# EAGLE design wide_vias (EAGLE 4.16)
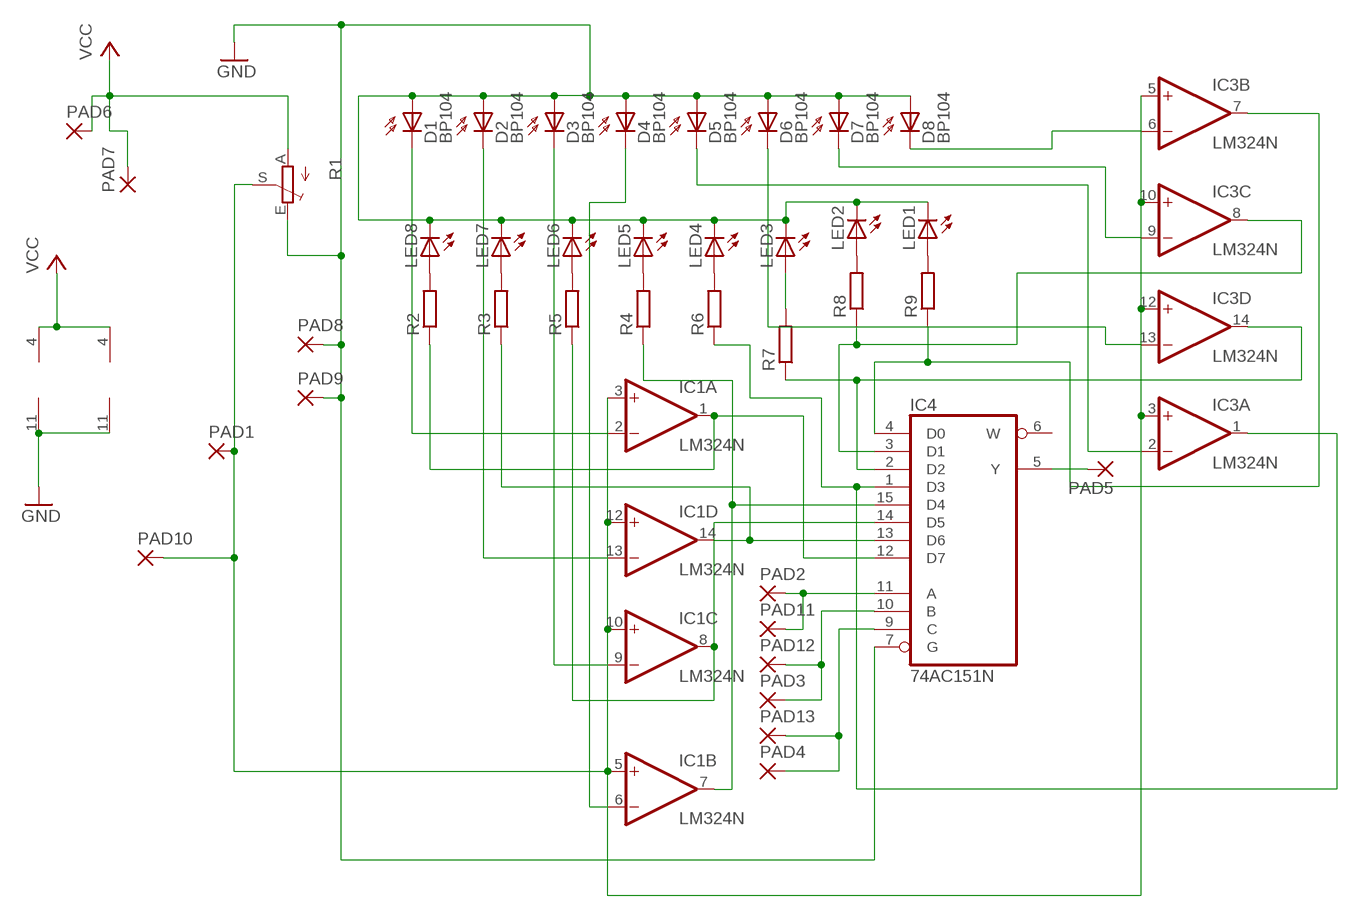
[diagram p0: schematic, sheet 1]

## Parts
D1  BP104  [BP104]
D2  BP104  [BP104]
D3  BP104  [BP104]
D4  BP104  [BP104]
D5  BP104  [BP104]
D6  BP104  [BP104]
D7  BP104  [BP104]
D8  BP104  [BP104]
IC1  LM324N  [DIL14]
IC3  LM324N  [DIL14]
IC4  74AC151N  [DIL16]
LED1  LED3MM  [LED3MM]
LED2  LED3MM  [LED3MM]
LED3  LED3MM  [LED3MM]
LED4  LED3MM  [LED3MM]
LED5  LED3MM  [LED3MM]
LED6  LED3MM  [LED3MM]
LED7  LED3MM  [LED3MM]
LED8  LED3MM  [LED3MM]
PAD1  2,54/1,0  [2,54/1,0]
PAD2  2,54/1,0  [2,54/1,0]
PAD3  2,54/1,0  [2,54/1,0]
PAD4  2,54/1,0  [2,54/1,0]
PAD5  2,54/1,0  [2,54/1,0]
PAD6  2,54/1,0  [2,54/1,0]
PAD7  2,54/1,0  [2,54/1,0]
PAD8  2,54/1,0  [2,54/1,0]
PAD9  2,54/1,0  [2,54/1,0]
PAD10  2,54/1,0  [2,54/1,0]
PAD11  2,54/1,0  [2,54/1,0]
PAD12  2,54/1,0  [2,54/1,0]
PAD13  2,54/1,0  [2,54/1,0]
R1  TRIM_EU-B25U  [B25U]
R2  R-EU_0207/10  [0207/10]
R3  R-EU_0207/10  [0207/10]
R4  R-EU_0207/12  [0207/12]
R5  R-EU_0207/12  [0207/12]
R6  R-EU_0207/10  [0207/10]
R7  R-EU_0207/10  [0207/10]
R8  R-EU_0207/10  [0207/10]
R9  R-EU_0207/10  [0207/10]

## Nets
B$1: IC1.1(A:OUT) IC4.12(D7) R2.1
GND: D1.A D2.A D3.A D4.A D5.A D6.A D7.A D8.A IC1.11(P:V-) IC3.11(P:V-) IC4.7(G) LED1.K(C) LED2.K(C) LED3.K(C) LED4.K(C) LED5.K(C) LED6.K(C) LED7.K(C) LED8.K(C) PAD8.1(P) PAD9.1(P) R1.E
N$1: D7.K(C) IC3.9(C:-IN)
N$2: D1.K(C) IC1.2(A:-IN)
N$3: D2.K(C) IC1.13(D:-IN)
N$4: D3.K(C) IC1.9(C:-IN)
N$5: D4.K(C) IC1.6(B:-IN)
N$6: IC1.14(D:OUT) IC4.13(D6) R3.1
N$7: LED1.A R9.2
N$8: IC1.7(B:OUT) IC4.15(D4) R4.1
N$9: D8.K(C) IC3.6(B:-IN)
N$10: LED5.A R4.2
N$11: D6.K(C) IC3.13(D:-IN)
N$12: D5.K(C) IC3.2(A:-IN)
N$13: IC4.5(Y) PAD5.1(P)
N$14: IC4.11(A) PAD2.1(P) PAD11.1(P)
N$15: IC4.10(B) PAD3.1(P) PAD12.1(P)
N$16: IC4.9(C) PAD4.1(P) PAD13.1(P)
N$17: LED2.A R8.2
N$18: IC3.7(B:OUT) IC4.4(D0) R9.1
N$19: IC3.8(C:OUT) IC4.3(D1) R8.1
N$20: IC3.14(D:OUT) IC4.2(D2) R7.1
N$21: IC3.1(A:OUT) IC4.1(D3) R6.1
N$22: LED3.A R7.2
N$23: LED4.A R6.2
N$24: LED6.A R5.2
N$26: LED7.A R3.2
N$27: LED8.A R2.2
N$28: IC1.3(A:+IN) IC1.5(B:+IN) IC1.10(C:+IN) IC1.12(D:+IN) IC3.3(A:+IN) IC3.5(B:+IN) IC3.10(C:+IN) IC3.12(D:+IN) PAD1.1(P) PAD10.1(P) R1.S
N$30: IC1.8(C:OUT) IC4.14(D5) R5.1
VCC: IC1.4(P:V+) IC3.4(P:V+) PAD6.1(P) PAD7.1(P) R1.A
Unconnected: IC4.6(W)

## Power pins joined to a net without a drawn wire
GND: IC4.8(GND)
VCC: IC4.16(VCC)

## Library data of the parts
D1-D8 = opto-trans-siemens:BP104: PHOTO DIODE
IC1 IC3 = linear:LM324: OP AMP
IC4 = 74xx-eu:74*151: Data SELECTOR/MULTIPLEXER
LED1-LED8 = led:LED: LED OSRAM: - CHIPLED LG R971, LG N971, LY N971, LG Q971, LY Q971, LO R971, LY R971 LH N974, LH R974 LS Q976, LO Q976, LY Q976 LO Q996 - Hyper CHIPLED LW Q18S LB Q993, LB Q99A, LB R99A - SideLED LS A670, LO A670, LY A670, LG A670, LP A670 LB A673, LV A673, LT A673, LW A673 LH A674 LY A675 LS A676, LA A676, LO A676, LY A676, LW A676 LS A679, LY A679, LG A679 - Hyper Micro SIDELED® LS Y876, LA Y876, LO Y876, LY Y876 LT Y87S - SmartLED LW L88C, LW L88S LB L89C, LB L89S, LG L890 LS L89K, LO L89K, LY L89K LS L896, LA L896, LO L896, LY L896 - TOPLED LS T670, LO T670, LY T670, LG T670, LP T670 LSG T670, LSP T670, LSY T670, LOP T670, LYG T670 LG T671, LOG T671, LSG T671 LB T673, LV T673, LT T673, LW T673 LH T674 LS T676, LA T676, LO T676, LY T676, LB T676, LH T676, LSB T676, LW T676 LB T67C, LV T67C, LT T67C, LS T67K, LO T67K, LY T67K, LW E67C LS E67B, LA E67B, LO E67B, LY E67B, LB E67C, LV E67C, LT E67C LW T67C LS T679, LY T679, LG T679 LS T770, LO T770, LY T770, LG T770, LP T770 LB T773, LV T773, LT T773, LW T773 LH T774 LS E675, LA E675, LY E675, LS T675 LS T776, LA T776, LO T776, LY T776, LB T776 LHGB T686 LT T68C, LB T68C - Hyper Mini TOPLED® LB M676 - Mini TOPLED Santana® LG M470 LS M47K, LO M47K, LY M47K Source: http://www.osram.convergy.de/
PAD1-PAD13 = wirepad:2,54/1,0: THROUGH-HOLE PAD
R1 = pot:TRIM_EU-: POTENTIOMETER
R2-R9 = rcl:R-EU_: RESISTOR, European symbol

## Board
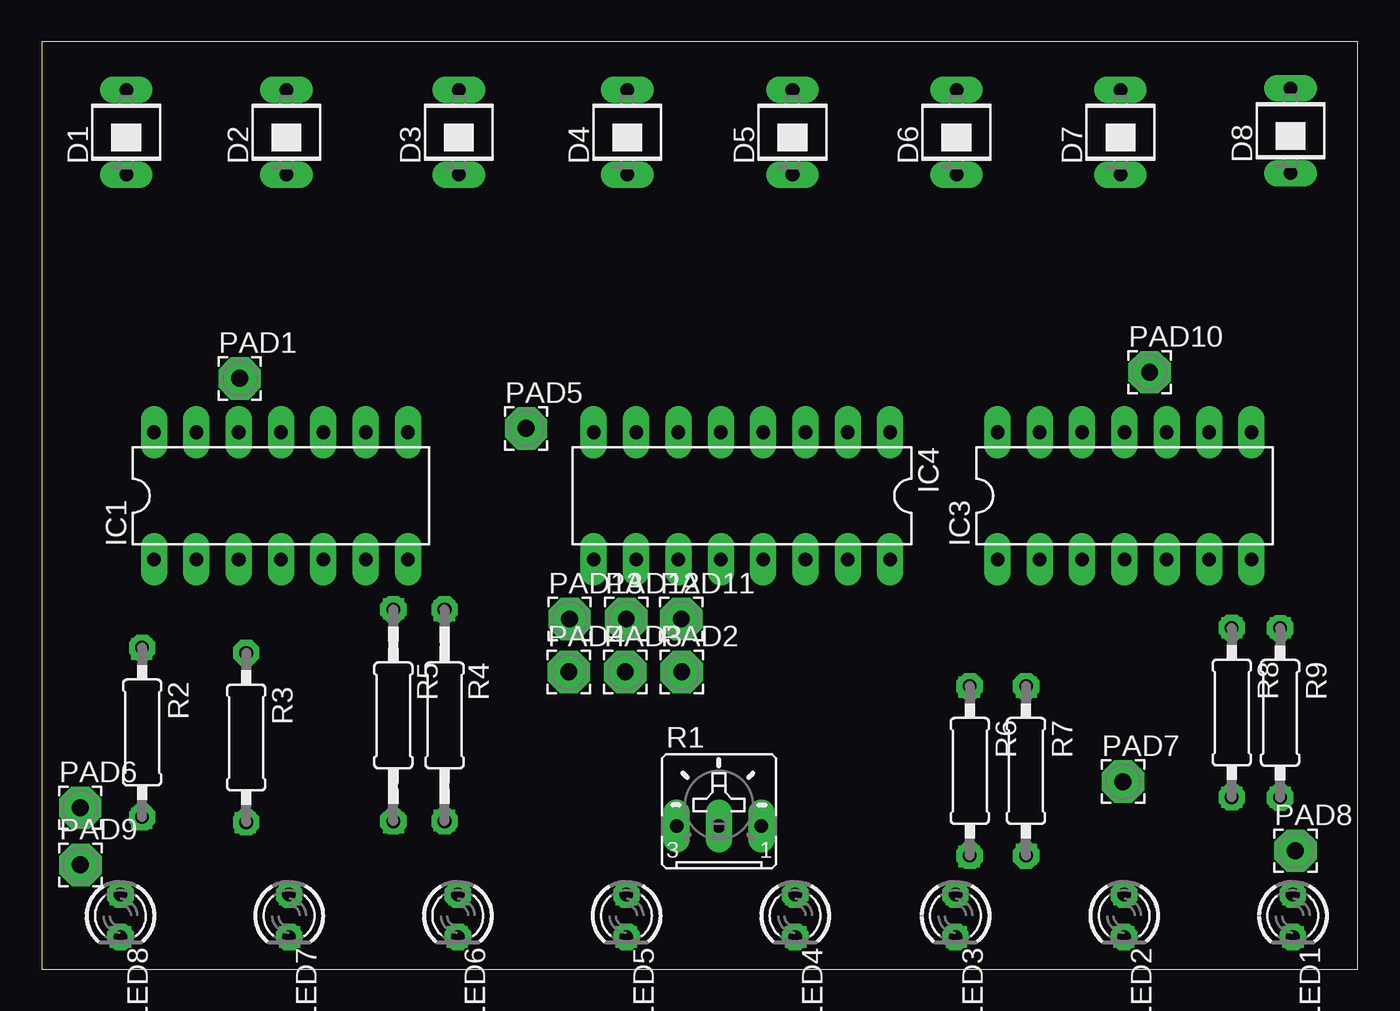
[diagram p1: board, top side]
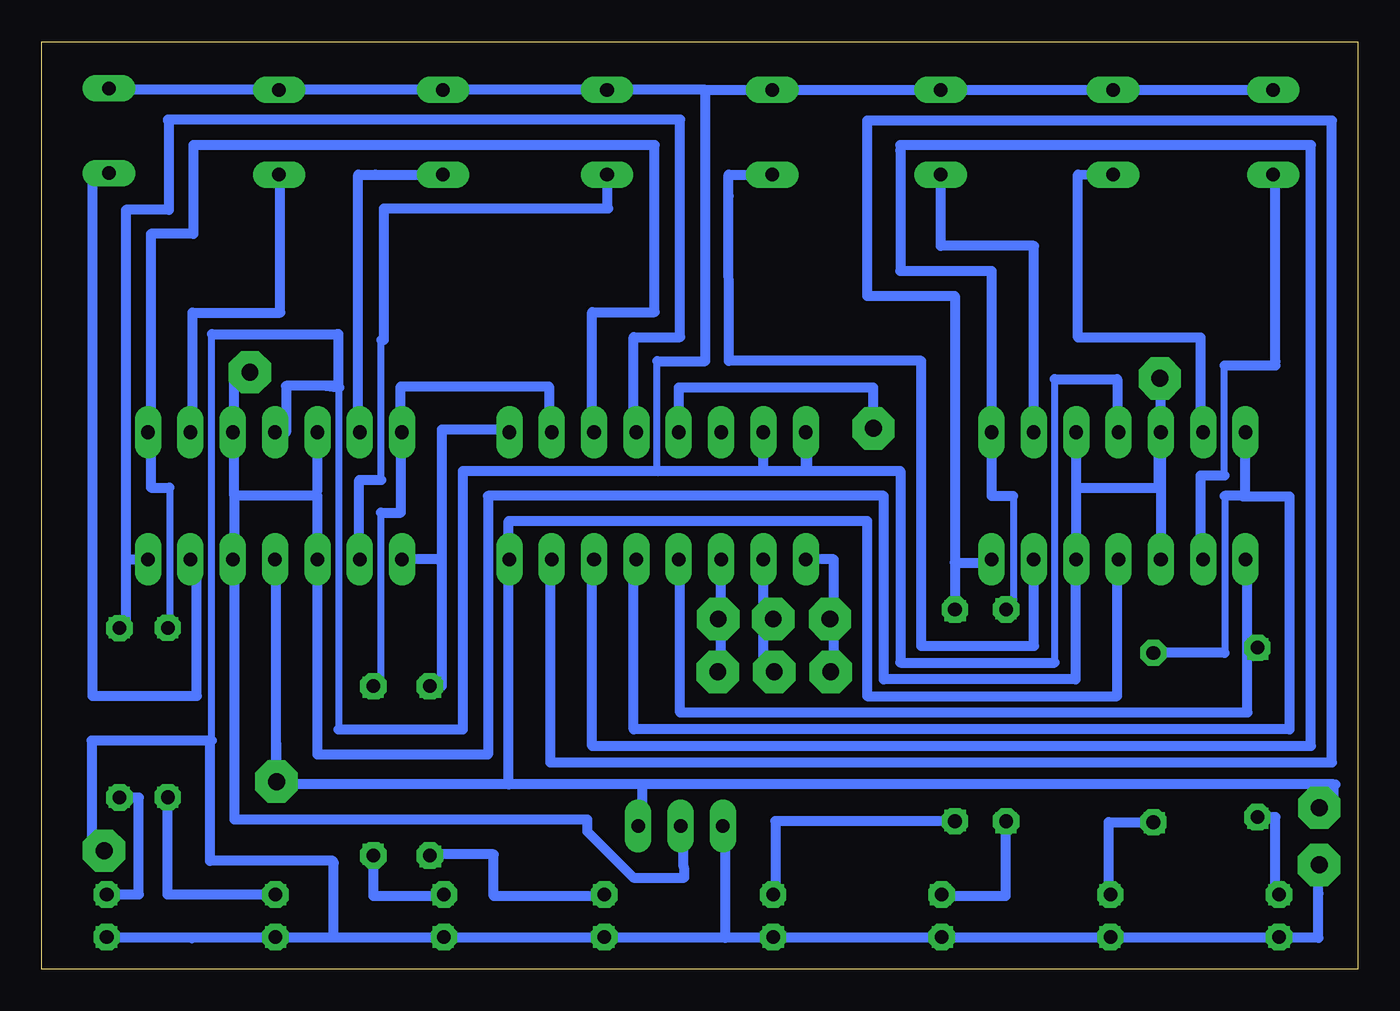
[diagram p2: board, bottom side, seen from below]

Size 78.97 x 55.62 mm. Coordinates in mm from the lower left corner, seen from the top.
Outline: 0,0 78.97,0 78.97,55.62 0,55.62 0,0
Copper layers (1*16): Top 0.035mm / dielectric 1.5mm / Bottom 0.035mm
Design rules "default": minimum track width 10mil, minimum drill 10mm, track to track 8mil, track to pad 8mil, pad to pad 8mil, via to via 8mil, smd to smd 8mil, copper to edge 40mil, drill to drill 8mil, minimum pad ring 15mil, minimum via ring 8mil, stop-mask expansion 4mil, vias tented up to drill 0mil, thermal gap 10mil

### Footprints (pad centres in the part's own frame; a part is rotated, then mirrored left to right if it is on the bottom)
BP104 = drill 0.813 long: A 0,2.54; K 0,-2.54
DIL14 = drill 0.813 long: 1 -7.62,-3.81; 2 -5.08,-3.81; 3 -2.54,-3.81; 4 0,-3.81; 5 2.54,-3.81; 6 5.08,-3.81; 7 7.62,-3.81; 8 7.62,3.81; 9 5.08,3.81; 10 2.54,3.81; 11 0,3.81; 12 -2.54,3.81; 13 -5.08,3.81; 14 -7.62,3.81
DIL16 = drill 0.813 long: 1 -8.89,-3.81; 2 -6.35,-3.81; 3 -3.81,-3.81; 4 -1.27,-3.81; 5 1.27,-3.81; 6 3.81,-3.81; 7 6.35,-3.81; 8 8.89,-3.81; 9 8.89,3.81; 10 6.35,3.81; 11 3.81,3.81; 12 1.27,3.81; 13 -1.27,3.81; 14 -3.81,3.81; 15 -6.35,3.81; 16 -8.89,3.81
LED3MM = drill 0.813 octagon: A -1.27,0; K 1.27,0
2,54/1,0 = drill 1.016 pad 2.54 octagon: 1 0,0
B25U = drill 0.813 long: A 2.54,-0.889; E -2.54,-0.889; S 0,-0.889
0207/10 = drill 0.813 octagon: 1 -5.08,0; 2 5.08,0
0207/12 = drill 0.813 octagon: 1 -6.35,0; 2 6.35,0

### Placement (x,y rotation side)
D1  5.08,50.19 0 top
D2  14.69,50.19 0 top
D3  25.03,50.19 0 top
D4  35.14,50.19 0 top
D5  45.05,50.19 0 top
D6  54.89,50.19 0 top
D7  64.73,50.19 0 top
D8  74.93,50.28 0 top
IC1  14.36,28.39 0 top
IC3  64.96,28.39 0 top
IC4  42.02,28.39 180 top
LED1  75.07,3.2 270 top
LED2  64.95,3.2 270 top
LED3  54.83,3.2 270 top
LED4  45.21,3.2 270 top
LED5  35.09,3.2 270 top
LED6  24.97,3.2 270 top
LED7  14.85,3.2 270 top
LED8  4.73,3.2 270 top
PAD1  11.88,35.43 0 top
PAD2  38.41,17.83 0 top
PAD3  35.02,17.83 0 top
PAD4  31.63,17.83 0 top
PAD5  29.07,32.43 0 top
PAD6  2.31,9.68 0 top
PAD7  64.87,11.25 0 top
PAD8  75.22,7.1 0 top
PAD9  2.32,6.25 0 top
PAD10  66.47,35.8 0 top
PAD11  38.38,21 0 top
PAD12  35.08,21 0 top
PAD13  31.68,21 0 top
R1  40.64,9.47 0 top
R2  6.03,14.2 270 top
R3  12.27,13.89 270 top
R4  24.17,15.22 270 top
R5  21.1,15.22 270 top
R6  55.68,11.89 270 top
R7  59.06,11.89 270 top
R8  71.4,15.39 270 top
R9  74.3,15.37 270 top

### Tracks (layer width: path | path; a pad name or v marks a point on that pad's centre or on a via)
B$1
  Bottom 0.61: IC1.1 6.63,24.58 6.63,19.2 | 6.63,19.2 6.63,15.39 40.67,15.39 40.67,24.58 IC4.12 | R2.1 6.63,19.28 6.63,19.2
GND  (via drill 0.5)
  Bottom 0.406: D5.A 45.45,52.73 45.45,52.88 | D6.A 54.95,52.73 54.95,52.88 | 75.45,52.73 75.45,52.88 74.95,52.88 74.95,52.82 D8.A | 75.07,1.88 LED1.K | 64.95,1.88 LED2.K | 54.83,1.88 LED3.K 61.45,1.93 | 35.45,32.38 35.67,32.38 IC4.7 35.65,32.2 | 64.31,32.2 IC3.11 | 61.16,34.88 61.16,14.38 | 32.95,32.2 32.95,32.38 | IC4.8 32.95,32.2 | 32.95,29.88 32.95,32.2 | 18.18,18.38 18.18,35.38 | 14.95,1.88 14.85,1.88 LED7.K | 4.73,1.88 LED8.K 4.45,1.93 4.45,1.88 | 24.97,1.88 LED6.K | 45.21,1.88 LED4.K | 35.09,1.88 LED5.K | 14.43,32.2 IC1.11 | 69.95,1.88 69.95,1.75 | 68.77,13.71 68.77,38.08 | 42.04,29.88 42.04,36.47 | 61.49,6.5 61.49,6.38 61.45,6.38
  Bottom 0.61: 45.45,52.73 D6.A | 75.45,52.73 D7.A 54.95,52.73 | 75.07,1.88 69.95,1.88 64.95,1.88 54.83,1.88 45.21,1.88 37.95,1.88 | 33.13,29.88 IC4.8 | 35.65,29.88 33.13,29.88 | 35.45,32.38 35.65,32.2 35.65,29.88 | 42.04,29.88 53.7,29.88 53.7,14.38 61.16,14.38 | 42.04,29.88 35.65,29.88 | 33.13,29.88 32.95,29.88 | 33.13,29.88 27.45,29.88 27.45,18.38 18.18,18.38 | 4.73,1.88 14.85,1.88 24.97,1.88 35.09,1.88 37.95,1.88 | 61.45,1.93 61.45,6.38 | 14.43,32.2 14.43,35.38 18.18,35.38 | PAD9.1 2.36,4.55 2.36,1.88 4.45,1.88 | 38.1,8.68 38.15,8.68 | 38.1,8.68 R1.E | 37.95,1.88 37.95,8.68 38.1,8.68 | 61.18,38.08 61.18,34.98 61.88,34.98 | 61.88,34.98 61.11,34.88 61.16,34.88 | 64.31,32.2 64.31,34.98 61.88,34.98 | 68.77,38.08 61.18,38.08 | 61.18,38.08 61.24,38.08 | 39.14,52.73 D5.A | 42.04,29.88 41.94,29.86 | 42.04,36.47 39.14,36.47 39.14,52.73 | D2.A D1.A | D2.A v14.76,52.73 v14.76,52.72 | 24.92,52.73 D3.A 35.08,52.73 | 24.92,52.73 D2.A | 24.92,52.73 24.92,52.72 | 35.08,52.73 D4.A 39.14,52.73 | 35.08,52.73 35.08,52.72 | PAD8.1 75.22,7 75.97,7 75.97,13.71 68.77,13.71 68.86,13.71 68.86,6.5 61.49,6.5
N$1
  Bottom 0.406: 64.65,47.65 D7.K | IC3.9 69.91,32.2
  Bottom 0.61: 64.65,47.65 64.65,39.38 69.91,39.38 69.91,32.2
N$2
  Bottom 0.406: 4.95,47.65 D1.K | IC1.2 8.93,24.58 8.93,23.88 9.23,23.88 | 8,29.61 8,36.21
  Bottom 0.61: 4.95,36.21 4.95,36.43 | 4.95,36.21 4.95,47.65 | 9.23,23.88 9.42,23.88 9.42,29.61 8,29.61 | 8,36.21 4.95,36.21
N$3
  Bottom 0.406: 9.43,32.38 9.28,32.38 IC1.13
  Bottom 0.61: D2.K 16.78,47.66 16.79,37.88 9.43,37.88 9.43,32.38
N$4
  Bottom 0.406: 19.43,32.38 19.44,32.38 IC1.9
  Bottom 0.61: D3.K 25.03,43.38 19.43,43.38 19.43,32.38
N$5
  Bottom 0.406: 19.43,24.88 19.44,24.88 IC1.6
  Bottom 0.61: D4.K 37.75,47.65 37.75,46.38 37.74,36.48 26.19,36.48 26.19,19.38 19.43,19.38 19.43,24.88
N$6
  Bottom 0.406: 43.45,24.58 IC4.13 | 7.99,28.38 7.99,18.97
  Bottom 0.61: 6.88,28.38 7.99,28.38 | 6.88,28.38 6.74,28.38 IC1.14 6.63,32.2 6.63,32.15 | 43.45,24.58 43.45,14.38 4.09,14.38 4.09,28.34 6.88,28.34 6.88,28.38 | 7.99,18.97 R3.1
N$7
  Bottom 0.406: LED1.A 74.95,4.47
  Bottom 0.61: 73.14,10.29 74.41,10.38 | 73.14,10.29 R9.2 | LED1.A 73.14,4.47 73.14,10.29
N$8
  Bottom 0.406: 21.98,24.38 IC1.7 | 48.45,24.58 IC4.15 | 23.93,21.57 R4.1
  Bottom 0.61: 24.18,24.38 21.98,24.38 | 24.18,24.38 24.18,40.38 29.45,40.38 29.45,50.89 1.55,50.89 1.55,12.38 48.45,12.38 48.45,24.58 | 24.18,24.38 24.18,21.74 23.9,21.74 23.93,21.57
N$9
  Bottom 0.406: 69.91,24.88 69.66,24.58 IC3.6
  Bottom 0.61: D8.K 75.91,47.74 75.91,16.38 69.66,16.38 69.66,24.58
N$10
  Bottom 0.61: 34.95,4.47 34.95,4.38 | 34.95,4.47 LED5.A | R4.2 34.95,8.87 34.95,4.47
N$11
  Bottom 0.61: IC3.13 59.97,32.2 59.97,47.64 58.95,47.64 58.95,47.65 D6.K
N$12
  Bottom 0.406: IC3.2 59.91,24.58 | 58.6,29.35 58.6,37.74
  Bottom 0.61: 58.6,29.35 59.91,29.35 59.91,24.58 | D5.K 45.05,45.61 | 58.6,37.74 58.45,37.74 58.45,45.61 45.05,45.61 | 44.98,45.61 45.05,45.61
N$13
  Bottom 0.61: PAD5.1 29.07,34.88 40.75,34.88 IC4.5
N$14
  Bottom 0.406: 38.21,17.88 38.95,17.88 38.95,17.38 38.41,17.38 PAD2.1
  Bottom 0.61: 38.21,17.88 38.21,21.28 | 38.21,21.28 IC4.11 | 38.21,21.28 38.35,21.28 38.35,21.4 PAD11.1
N$15
  Bottom 0.406: 35.02,17.38 34.95,17.38 | 35.02,17.38 PAD3.1 | 35.02,17.38 35.67,17.38
  Bottom 0.61: 35.67,17.38 35.67,21.28 | 35.67,21.28 IC4.10 | 35.67,21.28 35.55,21.28 35.55,21.3 PAD12.1
N$16
  Bottom 0.406: PAD4.1 31.45,17.83
  Bottom 0.61: IC4.9 31.45,24.58 31.45,21.08 | 31.45,17.83 31.45,21.08 | 31.45,21.08 31.55,21.08 31.55,21.2 PAD13.1
N$17
  Bottom 0.61: R8.2 71.41,10.38 | R8.2 | LED2.A 71.41,4.47 R8.2
N$18
  Bottom 0.406: IC4.4 43.45,32.2
  Bottom 0.61: 73.91,24.58 IC3.7 | 73.91,24.58 73.91,45.53 71.35,45.53 71.35,50.89 71.4,50.89 71.4,50.95 40.67,50.95 40.67,37.9 43.45,37.9 43.45,32.2 | 73.91,24.58 73.91,20.45 | 73.91,20.45 R9.1 | 73.91,20.45 73.91,20.38
N$19
  Bottom 0.406: IC4.3 45.95,32.2 | 71.3,28.88 71.3,20.38 | IC3.8 72.41,32.2
  Bottom 0.61: 45.95,32.2 45.95,39.4 42.19,39.4 42.19,49.42 69.88,49.42 69.88,44.09 72.42,44.09 72.42,32.2 IC3.8 | 71.3,28.88 72.41,28.88 72.41,32.2 | 71.3,20.38 71.41,20.38 R8.1
N$20
  Bottom 0.406: 48.45,32.2 IC4.2 | 56.91,31.88 57.41,31.88 57.41,32.2 IC3.14 | 58.61,16.97 58.61,27.38
  Bottom 0.61: 57.41,32.2 57.41,27.38 58.61,27.38 | R7.1 58.61,16.97 | 48.45,32.2 48.54,32.2 48.54,34.94 57.43,34.94 57.43,32.2 | 57.43,32.2 57.43,32.15 | IC3.14 57.43,32.2
N$21
  Bottom 0.406: 50.95,32.2 50.95,31.88 | R6.1 54.95,16.97 | 50.95,32.38 50.95,32.2 | 50.95,32.2 IC4.1
  Bottom 0.61: 54.95,16.97 54.95,24.53 | 54.95,24.53 54.95,32.38 50.95,32.38 | 54.95,24.53 55.14,24.53 55.14,24.58 IC3.1
N$22
  Bottom 0.406: LED3.A 54.83,4.38
  Bottom 0.61: R7.2 59.06,4.38 54.83,4.38
N$23
  Bottom 0.406: 54.93,6.88 R6.2 | 44.95,4.38 45.21,4.38 LED4.A
  Bottom 0.61: 54.93,6.88 51.85,6.88 51.85,4.38 45.21,4.38
N$24
  Bottom 0.61: R5.2 21.13,7.87 21.13,4.38 24.95,4.38 24.95,4.47 LED6.A
N$25  (via drill 0.5)
  other vias: 5.11,52.72
N$26
  Bottom 0.406: LED7.A 14.95,4.47
  Bottom 0.61: R3.2 14.95,8.81 14.95,4.47
N$27
  Bottom 0.406: 4.95,4.38 4.95,4.47 LED8.A
  Bottom 0.61: R2.2 4.95,9.12 4.95,4.47
N$28
  Bottom 0.406: 62.41,24.58 IC3.3 62.42,24.38 62.41,24.38 | 62.41,28.38 62.41,28.7 62.41,32.38 | IC1.5 16.9,24.38 16.93,24.38 | 11.82,32.38 IC1.12 | 11.93,32.38 11.82,32.38 | 16.9,28.88 16.93,28.88 | 67.41,24.58 IC3.5 | 40.45,8.58 R1.S | 67.41,32.18 67.41,32.2 IC3.10 | 67.41,35.8 PAD10.1 | 11.83,35.48 11.83,35.43 PAD1.1 | 11.82,32.38 11.83,32.38 | 40.41,5.99 40.45,6.02 40.45,6.13
  Bottom 0.61: 67.41,28.38 67.41,32.18 67.41,35.8 | 62.41,24.58 62.41,28.38 67.41,28.38 | 67.41,28.38 67.41,24.58 67.41,8.98 46.25,8.98 46.25,8.27 43.46,5.48 40.41,5.48 40.41,5.99 | 62.41,28.7 IC3.12 | 16.9,24.38 16.9,28.88 | 16.9,28.88 IC1.10 | 11.82,32.38 IC1.3 | 11.93,32.38 11.93,28.88 16.9,28.88 | 16.93,24.38 16.93,17.38 28.45,17.38 28.45,28.38 52.2,28.38 52.2,12.87 62.41,12.87 62.41,24.38 | 40.45,6.13 40.45,8.58 | 11.83,32.38 11.83,35.43
N$29  (via drill 0.5)
  other vias: 5.11,47.64
N$30
  Bottom 0.406: 45.95,24.58 IC4.14 | 20.68,28.38 20.68,21.38 21.43,21.38 21.43,21.57 R5.1
  Bottom 0.61: 45.95,24.58 45.95,13.38 2.82,13.38 2.82,49.42 27.46,49.42 27.46,49.1 27.45,49.1 27.45,41.88 21.98,41.88 IC1.8 21.98,28.38 20.68,28.38
N$31  (via drill 0.5)
  other vias: 14.76,47.64
N$32  (via drill 0.5 pad 1.27)
  other vias: 25.04,52.72
N$33  (via drill 0.5 pad 1.27)
  other vias: 25.04,47.64
N$34  (via drill 0.5 pad 1.27)
  other vias: 35.21,52.72
N$35  (via drill 0.5 pad 1.27)
  other vias: 35.21,47.64
N$36  (via drill 0.5 pad 1.27)
  other vias: 45.11,52.72
N$37  (via drill 0.5 pad 1.27)
  other vias: 45.11,47.64
N$38  (via drill 0.5 pad 1.27)
  other vias: 54.89,52.72
N$39  (via drill 0.5 pad 1.27)
  other vias: 54.89,47.64
N$40  (via drill 0.5 pad 1.27)
  other vias: 64.67,52.72
N$41  (via drill 0.5 pad 1.27)
  other vias: 64.67,47.64
N$42  (via drill 0.5 pad 1.27)
  other vias: 74.96,52.85
N$43  (via drill 0.5 pad 1.27)
  other vias: 74.96,47.77
N$44  (via drill 0.5 pad 1.27)
  other vias: 66.45,35.83
N$45  (via drill 0.5 pad 1.27)
  other vias: 72.54,32.15
N$46  (via drill 0.5 pad 1.27)
  other vias: 70,32.15
N$47  (via drill 0.5 pad 1.27)
  other vias: 67.46,32.15
N$48  (via drill 0.5 pad 1.27)
  other vias: 64.92,32.15
N$49  (via drill 0.5 pad 1.27)
  other vias: 62.38,32.15
N$50  (via drill 0.5 pad 1.27)
  other vias: 59.84,32.15
N$51  (via drill 0.5 pad 1.27)
  other vias: 57.3,32.15
N$52  (via drill 0.5 pad 1.27)
  other vias: 72.54,24.53
N$53  (via drill 0.5 pad 1.27)
  other vias: 70,24.53
N$54  (via drill 0.5 pad 1.27)
  other vias: 67.46,24.53
N$55  (via drill 0.5 pad 1.27)
  other vias: 64.92,24.53
N$56  (via drill 0.5 pad 1.27)
  other vias: 62.38,24.53
N$57  (via drill 0.5 pad 1.27)
  other vias: 57.3,24.53
N$58  (via drill 0.5 pad 1.27)
  other vias: 59.84,24.53
N$59  (via drill 0.5 pad 1.27)
  other vias: 50.95,24.53
N$60  (via drill 0.5 pad 1.27)
  other vias: 48.41,24.53
N$61  (via drill 0.5 pad 1.27)
  other vias: 45.87,24.53
N$62  (via drill 0.5 pad 1.27)
  other vias: 43.33,24.53
N$63  (via drill 0.5 pad 1.27)
  other vias: 40.79,24.53
N$64  (via drill 0.5 pad 1.27)
  other vias: 38.25,24.53
N$65  (via drill 0.5 pad 1.27)
  other vias: 35.71,24.53
N$66  (via drill 0.5 pad 1.27)
  other vias: 33.17,24.53
N$67  (via drill 0.5 pad 1.27)
  other vias: 22,24.53
N$68  (via drill 0.5 pad 1.27)
  other vias: 19.46,24.53
N$69  (via drill 0.5 pad 1.27)
  other vias: 16.92,24.53
N$70  (via drill 0.5 pad 1.27)
  other vias: 14.38,24.53
N$71  (via drill 0.5 pad 1.27)
  other vias: 11.84,24.53
N$72  (via drill 0.5 pad 1.27)
  other vias: 9.3,24.53
N$73  (via drill 0.5 pad 1.27)
  other vias: 6.76,24.53
N$74  (via drill 0.5 pad 1.27)
  other vias: 11.84,35.45
N$75  (via drill 0.5 pad 1.27)
  other vias: 29.11,32.53
N$76  (via drill 0.5 pad 1.27)
  other vias: 50.95,32.15
N$77  (via drill 0.5 pad 1.27)
  other vias: 48.41,32.15
N$78  (via drill 0.5 pad 1.27)
  other vias: 45.87,32.15
N$79  (via drill 0.5 pad 1.27)
  other vias: 43.33,32.15
N$80  (via drill 0.5 pad 1.27)
  other vias: 40.79,32.15
N$81  (via drill 0.5 pad 1.27)
  other vias: 38.25,32.15
N$82  (via drill 0.5 pad 1.27)
  other vias: 35.71,32.15
N$83  (via drill 0.5 pad 1.27)
  other vias: 33.17,32.15
N$84  (via drill 0.5 pad 1.27)
  other vias: 22,32.15
N$85  (via drill 0.5 pad 1.27)
  other vias: 19.46,32.15
N$86  (via drill 0.5 pad 1.27)
  other vias: 16.92,32.15
N$87  (via drill 0.5 pad 1.27)
  other vias: 14.38,32.15
N$88  (via drill 0.5 pad 1.27)
  other vias: 11.84,32.15
N$89  (via drill 0.5 pad 1.27)
  other vias: 9.42,32.15
N$90  (via drill 0.5 pad 1.27)
  other vias: 6.76,32.15
N$91  (via drill 0.5 pad 1.27)
  other vias: 31.65,20.97
N$92  (via drill 0.5 pad 1.27)
  other vias: 35.08,20.97
N$93  (via drill 0.5 pad 1.27)
  other vias: 38.38,20.97
N$94  (via drill 0.5 pad 1.27)
  other vias: 38.38,17.8
N$95  (via drill 0.5 pad 1.27)
  other vias: 34.95,17.8
N$96  (via drill 0.5 pad 1.27)
  other vias: 31.65,17.8
N$97  (via drill 0.5 pad 1.27)
  other vias: 24.16,21.48
N$98  (via drill 0.5 pad 1.27)
  other vias: 21.11,21.61
N$99  (via drill 0.5 pad 1.27)
  other vias: 6,19.2
N$100  (via drill 0.5 pad 1.27)
  other vias: 6,9.04
N$101  (via drill 0.5 pad 1.27)
  other vias: 12.22,8.78
N$102  (via drill 0.5 pad 1.27)
  other vias: 2.31,9.67
N$103  (via drill 0.5 pad 1.27)
  other vias: 2.31,6.24
N$104  (via drill 0.5 pad 1.27)
  other vias: 4.72,4.46
N$105  (via drill 0.5 pad 1.27)
  other vias: 4.72,1.92
N$106  (via drill 0.5 pad 1.27)
  other vias: 14.88,1.92
N$107  (via drill 0.5 pad 1.27)
  other vias: 14.88,4.46
N$108  (via drill 0.5 pad 1.27)
  other vias: 21.11,8.78
N$109  (via drill 0.5 pad 1.27)
  other vias: 24.16,8.91
N$110  (via drill 0.5 pad 1.27)
  other vias: 25.04,4.46
N$111  (via drill 0.5 pad 1.27)
  other vias: 24.92,1.92
N$112  (via drill 0.5 pad 1.27)
  other vias: 35.08,4.46
N$113  (via drill 0.5 pad 1.27)
  other vias: 35.08,1.92
N$114  (via drill 0.5 pad 1.27)
  other vias: 45.24,4.46
N$115  (via drill 0.5 pad 1.27)
  other vias: 45.24,1.92
N$116  (via drill 0.5 pad 1.27)
  other vias: 43.21,8.65
N$117  (via drill 0.5 pad 1.27)
  other vias: 40.67,8.65
N$118  (via drill 0.5 pad 1.27)
  other vias: 38.13,8.65
N$119  (via drill 0.5 pad 1.27)
  other vias: 54.89,4.46
N$120  (via drill 0.5 pad 1.27)
  other vias: 54.89,1.92
N$121  (via drill 0.5 pad 1.27)
  other vias: 55.65,6.75
N$122  (via drill 0.5 pad 1.27)
  other vias: 59.08,6.88
N$123  (via drill 0.5 pad 1.27)
  other vias: 64.8,11.32
N$124  (via drill 0.5 pad 1.27)
  other vias: 64.92,4.46
N$125  (via drill 0.5 pad 1.27)
  other vias: 64.92,1.92
N$126  (via drill 0.5 pad 1.27)
  other vias: 75.08,1.92
N$127  (via drill 0.5 pad 1.27)
  other vias: 75.08,4.46
N$128  (via drill 0.5 pad 1.27)
  other vias: 75.21,7.13
N$129  (via drill 0.5 pad 1.27)
  other vias: 74.32,10.31
N$130  (via drill 0.5 pad 1.27)
  other vias: 71.4,10.31
N$131  (via drill 0.5 pad 1.27)
  other vias: 59.08,16.91
N$132  (via drill 0.5 pad 1.27)
  other vias: 55.65,16.91
N$133  (via drill 0.5 pad 1.27)
  other vias: 71.4,20.47
N$134  (via drill 0.5 pad 1.27)
  other vias: 74.32,20.47
VCC
  Bottom 0.406: 14.43,24.58 IC1.4 | 50.95,24.38 50.95,24.58 IC4.16 | 64.91,24.58 IC3.4 | 42.95,8.58 R1.A
  Bottom 0.61: 14.43,24.58 14.43,16.38 29.45,16.38 29.45,26.88 50.95,26.88 50.95,24.58 50.95,11.08 | 64.91,13.58 64.91,24.58 | 42.95,11.08 42.95,8.58 | 50.95,11.08 64.91,11.08 64.91,13.58 | 42.95,11.08 50.95,11.08 | PAD6.1 1.45,9.68 1.45,11.08 | 64.91,13.58 64.91,13.55 PAD7.1 | 1.45,11.08 1.35,11.08 | 1.45,11.08 42.95,11.08